# EAGLE schematic Thetis_RevF1_SCH (EAGLE 9.7.0)
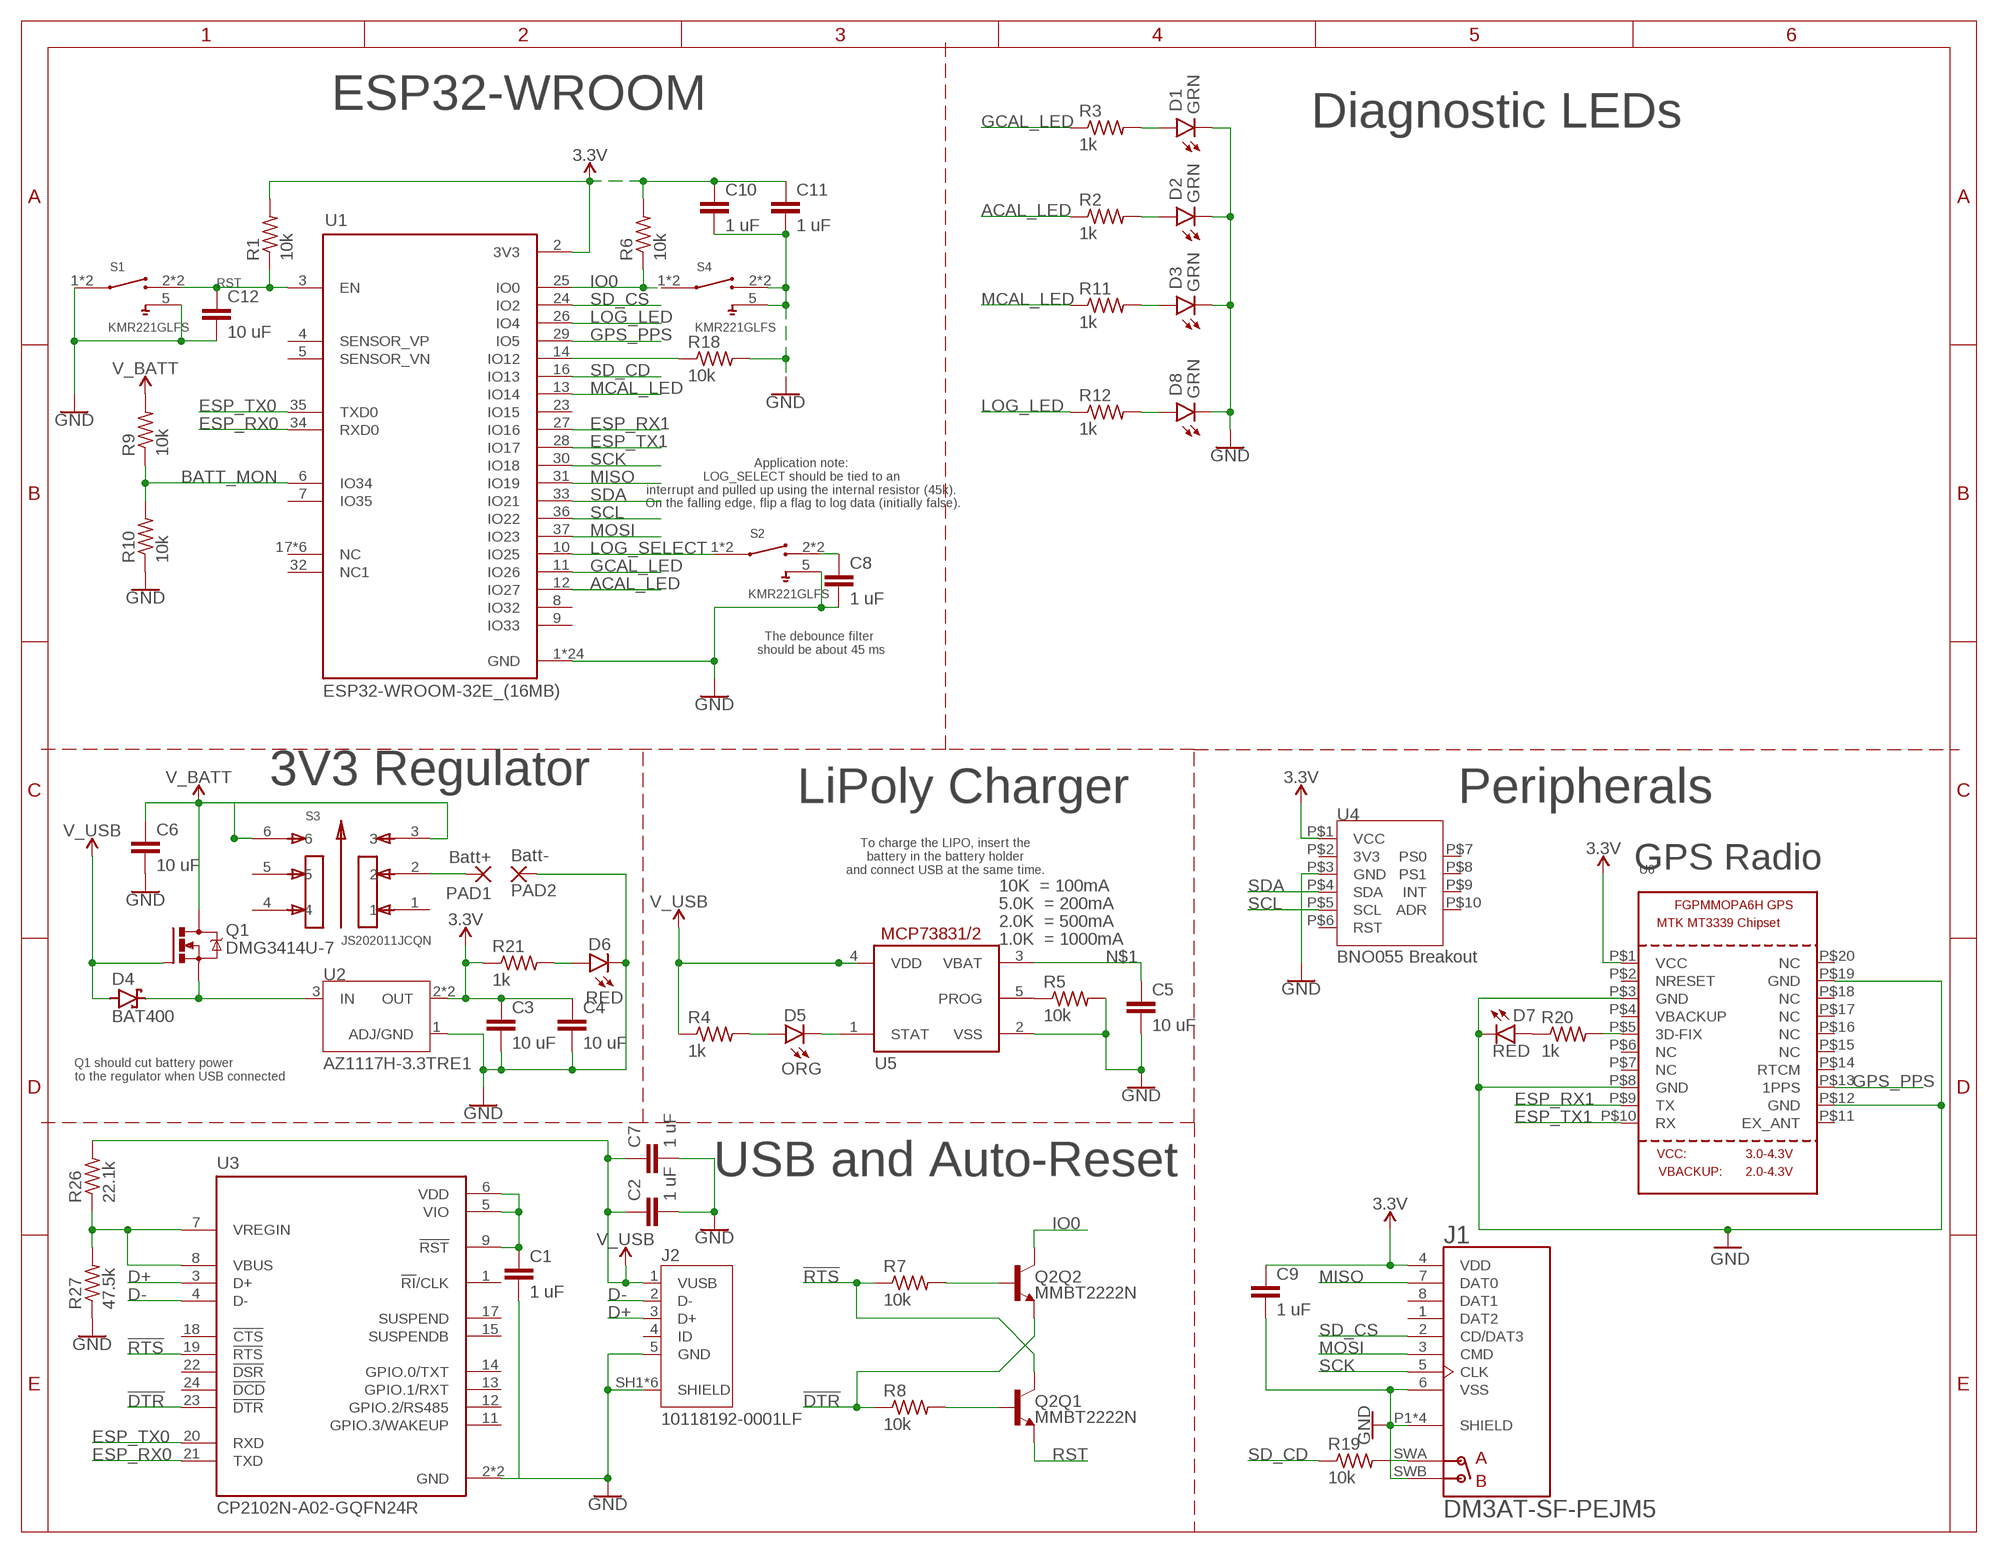
[diagram p0: schematic, sheet 1]

## Parts
C1  1 uF  C-EUC0603  [C0603]
C2  1 uF  C-EUC0603  [C0603]
C3  10 uF  C-EUC0603  [C0603]
C4  10 uF  C-EUC0603  [C0603]
C5  10 uF  C-EUC0603  [C0603]
C6  10 uF  C-EUC0603  [C0603]
C7  1 uF  C-EUC0603  [C0603]
C8  1 uF  C-EUC0603  [C0603]
C9  1 uF  C-EUC0603  [C0603]
C10  1 uF  C-EUC0603  [C0603]
C11  1 uF  C-EUC0603  [C0603]
C12  10 uF  C-EUC0603  [C0603]
D1  GRN  CHIP-ROUND-G_0603  [LEDC1608X65N]
D2  GRN  CHIP-ROUND-G_0603  [LEDC1608X65N]
D3  GRN  CHIP-ROUND-G_0603  [LEDC1608X65N]
D4  BAT400  BAS40  [SOT23]
D5  ORG  CHIP-ROUND-G_0603  [LEDC1608X65N]
D6  RED  CHIP-ROUND-G_0603  [LEDC1608X65N]
D7  RED  CHIP-FLAT-Y_0603-0.35MM  [LEDC1608X35N]
D8  GRN  CHIP-ROUND-G_0603  [LEDC1608X65N]
J1  DM3AT-SF-PEJM5  [HRS_DM3AT-SF-PEJM5]
J2  10118192-0001LF  [AMPHENOL_10118192-0001LF]
PAD1  Batt+  SMD5  [SMD2,54-5,08]
PAD2  Batt-  SMD5  [SMD2,54-5,08]
Q1  DMG3414U-7  NMOSFETSOT23  [SOT23]
Q2  MMBT2222N  TRANS_NPN_DUAL-MBT3904DW1T1  [SC70-6]
R1  10k  R-US_R0603  [R0603]
R2  1k  R-US_R0603  [R0603]
R3  1k  R-US_R0603  [R0603]
R4  1k  R-US_R0603  [R0603]
R5  10k  R-US_R0603  [R0603]
R6  10k  R-US_R0603  [R0603]
R7  10k  R-US_R0603  [R0603]
R8  10k  R-US_R0603  [R0603]
R9  10k  R-US_R0603  [R0603]
R10  10k  R-US_R0603  [R0603]
R11  1k  R-US_R0603  [R0603]
R12  1k  R-US_R0603  [R0603]
R18  10k  R-US_R0603  [R0603]
R19  10k  R-US_R0603  [R0603]
R20  1k  R-US_R0603  [R0603]
R21  1k  R-US_R0603  [R0603]
R26  22.1k  R-US_R0603  [R0603]
R27  47.5k  R-US_R0603  [R0603]
S1  KMR221GLFS  [SW_KMR221GLFS]
S2  KMR221GLFS  [SW_KMR221GLFS]
S3  JS202011JCQN  [SW_JS202011JCQN]
S4  KMR221GLFS  [SW_KMR221GLFS]
U1  ESP32-WROOM-32E_(16MB)  [MODULE_ESP32-WROOM-32E_(16MB)]
U2  AZ1117H-3.3TRE1  AZ1117EH-5.0TRG1  [SOT230P700X180-4N]
U3  CP2102N-A02-GQFN24R  [QFN50P400X400X80-25N]
U4  BNO055 Breakout  ADAFRUIT-BNO055-BREAKOUT-SMD  [ADAFRUIT-BNO055-BREAKOUT-SMD]
U5  MCP73831/OT  [SOT23-5L]
U6  GPS_FGPMMOPA6H  [FGPMMOPA6H]

## Nets
3.3V: C3.1 C4.1 C9.1 C10.1 C11.1 J1.4(VDD) R1.2 R6.2 R21.1 U1.2(3V3) U2.2(OUT) U2.4(OUT) U4.P$1(VCC) U6.P$1(VCC)
!DTR: Q2.1(Q2:E) R8.1 U3.23(!DTR)
!RTS: Q2.3(Q1:C) R7.1 U3.19(!RTS)
ACAL_LED: R2.1 U1.12(IO27)
BATT_MON: R9.1 R10.2 U1.6(IO34)
D+: J2.3(D+) U3.3(D+)
D-: J2.2(D-) U3.4(D-)
ESP_RX0: U1.34(RXD0) U3.21(TXD)
ESP_RX1: U1.27(IO16) U6.P$9(TX)
ESP_TX0: U1.35(TXD0) U3.20(RXD)
ESP_TX1: U1.28(IO17) U6.P$10(RX)
GCAL_LED: R3.1 U1.11(IO26)
GND: C1.2 C2.2 C3.2 C4.2 C5.2 C6.2 C7.2 C8.2 C9.2 C10.2 C11.2 C12.2 D1.C D2.C D3.C D6.C D7.C D8.C J1.6(VSS) J1.P1(SHIELD) J1.P2(SHIELD) J1.P3(SHIELD) J1.P4(SHIELD) J1.SWB(B) J2.5(GND) J2.SH1(SHIELD) J2.SH2(SHIELD) J2.SH3(SHIELD) J2.SH4(SHIELD) J2.SH5(SHIELD) J2.SH6(SHIELD) PAD2.1(P) R5.2 R10.1 R18.2 R27.1 S1.1 S1.4 S1.5 S2.5 S4.2 S4.3 S4.5 U1.1(GND) U1.15(GND) U1.38(GND) U1.39_1(GND) U1.39_2(GND) U1.39_3(GND) U1.39_4(GND) U1.39_5(GND) U1.39_6(GND) U1.39_7(GND) U1.39_8(GND) U1.39_9(GND) U1.39_10(GND) U1.39_11(GND) U1.39_12(GND) U1.39_13(GND) U1.39_14(GND) U1.39_15(GND) U1.39_16(GND) U1.39_17(GND) U1.39_18(GND) U1.39_19(GND) U1.39_20(GND) U1.39_21(GND) U2.1(ADJ/GND) U3.2(GND) U3.25(GND) U4.P$3(GND) U5.2(VSS) U6.P$3(GND) U6.P$8(GND) U6.P$12(GND) U6.P$19(GND)
GPS_PPS: U1.29(IO5) U6.P$13(1PPS)
IO0: Q2.6(Q2:C) R6.1 S4.1 S4.4 U1.25(IO0)
LOG_LED: R12.1 U1.26(IO4)
LOG_SELECT: S2.1 S2.4 U1.10(IO25)
MCAL_LED: R11.1 U1.13(IO14)
MISO: J1.7(DAT0) U1.31(IO19)
MOSI: J1.3(CMD) U1.37(IO23)
N$1: C5.1 PAD1.1(P) S3.2 U5.3(VBAT)
N$2: D7.A R20.1
N$3: R20.2 U6.P$5(3D-FIX)
N$5: R18.1 U1.14(IO12)
N$7: Q2.5(Q1:B) R8.2
N$8: D1.A R3.2
N$9: Q2.2(Q2:B) R7.2
N$10: C8.1 S2.2 S2.3
N$11: D2.A R2.2
N$13: D4.3(C) Q1.2(S) U2.3(IN)
N$14: D3.A R11.2
N$16: D8.A R12.2
N$18: C1.1 U3.5(VIO) U3.6(VDD) U3.9(!RST)
N$19: R26.1 R27.2 U3.7(VREGIN) U3.8(VBUS)
N$20: D5.A R4.2
N$21: D5.C U5.1(STAT)
N$22: R5.1 U5.5(PROG)
N$23: J1.SWA(A) R19.2
N$24: D6.A R21.2
RST: C12.1 Q2.4(Q1:E) R1.1 S1.2 S1.3 U1.3(EN)
SCK: J1.5(CLK) U1.30(IO18)
SCL: U1.36(IO22) U4.P$5(SCL)
SD_CD: R19.1 U1.16(IO13)
SD_CS: J1.2(CD/DAT3) U1.24(IO2)
SDA: U1.33(IO21) U4.P$4(SDA)
V_BATT: C6.1 Q1.3(D) R9.2 S3.3 S3.6
V_USB: C2.1 C7.1 D4.1(A) J2.1(VUSB) Q1.1(G) R4.1 R26.2 U5.4(VDD)
Unconnected: J1.1(DAT2) J1.8(DAT1) J2.4(ID) S3.1 S3.4 S3.5 U1.4(SENSOR_VP) U1.5(SENSOR_VN) U1.7(IO35) U1.8(IO32) U1.9(IO33) U1.17(NC) U1.18(NC) U1.19(NC) U1.20(NC) U1.21(NC) U1.22(NC) U1.23(IO15) U1.32(NC1) U3.1(!RI!/CLK) U3.11(GPIO.3/WAKEUP) U3.12(GPIO.2/RS485) U3.13(GPIO.1/RXT) U3.14(GPIO.0/TXT) U3.15(SUSPENDB) U3.17(SUSPEND) U3.18(!CTS) U3.22(!DSR) U3.24(!DCD) U4.P$6(RST) U4.P$7(PS0) U4.P$8(PS1) U4.P$9(INT) U4.P$10(ADR) U6.P$2(NRESET) U6.P$4(VBACKUP) U6.P$6(NC) U6.P$7(NC) U6.P$11(EX_ANT) U6.P$14(RTCM) U6.P$15(NC) U6.P$16(NC) U6.P$17(NC) U6.P$18(NC) U6.P$20(NC)

## Notes on the sheet
- ESP32-WROOM
- Diagnostic LEDs
- Application note: 
  LOG_SELECT should be tied to an 
  interrupt and pulled up using the internal resistor (45k). 
  On the falling edge, flip a flag to log data (initially false).
- The debounce filter 
  should be about 45 ms
- 3V3 Regulator
- LiPoly Charger | Peripherals
- To charge the LIPO, insert the
  battery in the battery holder
  and connect USB at the same time.
- GPS Radio
- 10K  = 100mA
- 5.0K  = 200mA
- 2.0K  = 500mA
- 1.0K  = 1000mA
- Q1 should cut battery power
  to the regulator when USB connected
- USB and Auto-Reset

## Power pins joined to a net without a drawn wire
3V3: U4.P$2(3V3)

## Library data of the parts
C1-C12 = rcl:C-EU: CAPACITOR, European symbol; SPICEPREFIX: C
D1-D3 D5 D6 D8 = LED:CHIP-ROUND-G; CATEGORY: LED; COLOR: GREEN; DESCRIPTION: CHIP LED ROUND; SUB-CATEGORY: CHIP; TYPE: ROUND_TOP
D4 = diode:BAS40: Silicon Schottky Diodes General-purpose diode for high-speed switching
D7 = LED:CHIP-FLAT-Y; CATEGORY: LED; COLOR: YELLOW; DESCRIPTION: CHIP LED FLAT; SUB-CATEGORY: CHIP; TYPE: FLAT_TOP
J1 = DM3AT-SF-PEJM5:DM3AT-SF-PEJM5: DM3 Series 8 Position Right Angle SMT Push Push Ejection MicroSD Card Connector; AVAILABILITY: Unavailable; DESCRIPTION: DM3 RA SMT microSD memory card push/push; MF: Hirose; MP: DM3AT-SF-PEJM5; PACKAGE: None; PRICE: None
J2 = MicroUSB:10118192-0001LF: Single Port 5 Contact Horizontal Right Angle Shielded Micro B USB 2.0 Connector; MANUFACTURER: Amphenol; PARTREV: B; STANDARD: Manufacturer Recommendation
PAD1 PAD2 = wirepad:SMD5: SMD PAD
Q1 = Transistor:NMOSFET: N-Channel MOSFET - Generic; CATEGORY: Transistor; SUB-CATEGORY: MOSFET; TYPE: N-Channel; VALUE: NMOSFET
Q2 = SparkFun-DiscreteSemi-Poseidon-Edit:TRANS_NPN_DUAL: Dual NPN Transistors in Single Package The MBT3904W1 puts two general purpose 3904 NPN transistors in a single package. Datasheet <http://www.onsemi.com/pub_link/Collateral/MBT3904DW1T1-D.PDF> SparkFun Products: SparkFun ESP32 Thing <https://www.sparkfun.com/products/13907>; PROD_ID: TRANS-13337
R1-R12 R18-R21 R26 R27 = rcl:R-US_: RESISTOR, American symbol; SPICEPREFIX: R
S1 S2 S4 = KMR221GLFS:KMR221GLFS: Switch Tactile N.O. SPST Button Gull Wing 0.05A 32VDC 1VA 200000Cycles 2N SMD Automotive T/R; MANUFACTURER: CnK
S3 = JS202011SCQN:JS202011JCQN
U1 = ESP32-WROOM-32E:ESP32-WROOM-32E_(16MB): Bluetooth, WiFi 802.11b/g/n, Bluetooth v4.2 +EDR, Class 1, 2 and 3 Transceiver Module 2.4GHz ~ 2.5GHz Integrated, Trace Surface Mount; MANUFACTURER: Espressif Systems; MAXIMUM_PACKAGE_HEIGHT: 3.25mm; PARTREV: 1.1; STANDARD: Manufacturer Recommendations
U2 = AZ1117EH-5.0TRG1:AZ1117EH-5.0TRG1; ARROW_ELECTRONICS-PURCHASE-URL: https://snapeda.com/shop?store=Arrow+Electronics&id=482930; AVAILABILITY: Good; DESCRIPTION: Linear Voltage Regulator IC 1 Output 1A SOT-223; DIGIKEY-PURCHASE-URL: https://snapeda.com/shop?store=DigiKey&id=482930; MF: Diodes Inc.; MOUSER-PURCHASE-URL: https://snapeda.com/shop?store=Mouser&id=482930; MP: AZ1117EH-5.0TRG1; PACKAGE: SOT-223 Diodes Inc.; PRICE: None
U3 = CP2102N-A02-GQFN24R:CP2102N-A02-GQFN24R; A_MAX: 0.8; B_MAX: 0.3; B_MIN: 0.18; B_NOM: 0.24; D2_NOM: 2.45; D_MAX: 4.0; D_MIN: 4.0; D_NOM: 4.0; E2_NOM: 2.45; ENOM: 0.5; E_MAX: 4.0; E_MIN: 4.0; E_NOM: 4.0; L_MAX: 0.5; L_MIN: 0.3; L_NOM: 0.4; MANUFACTURER: Silicon Labs; PARTREV: 1.3; PIN_COUNT_D: 6.0; PIN_COUNT_E: 6.0; STANDARD: IPC 7351B
U4 = EVE-ECAD-Library:ADAFRUIT-BNO055-BREAKOUT
U5 = adafruit - EVE Edit:MCP73831: MCP73831/2 Miniature Single-Cell, Fully Integrated Li-Ion, Li-Polymer Charge Management Controllers. Nice and small simple lipoly charge controller, with adjustable current and status output (LED) http://www.ladyada.net/library/pcb/eaglelibrary.html
U6 = adafruit - EVE Edit:GPS_FGPMMOPA6H: GPS Module - MTK MT3339 Chipset, -165dBm sensitivity, 22 channels, 10Hz, auto-select external antenna options

## Net classes
0 default: width 0.178 mm